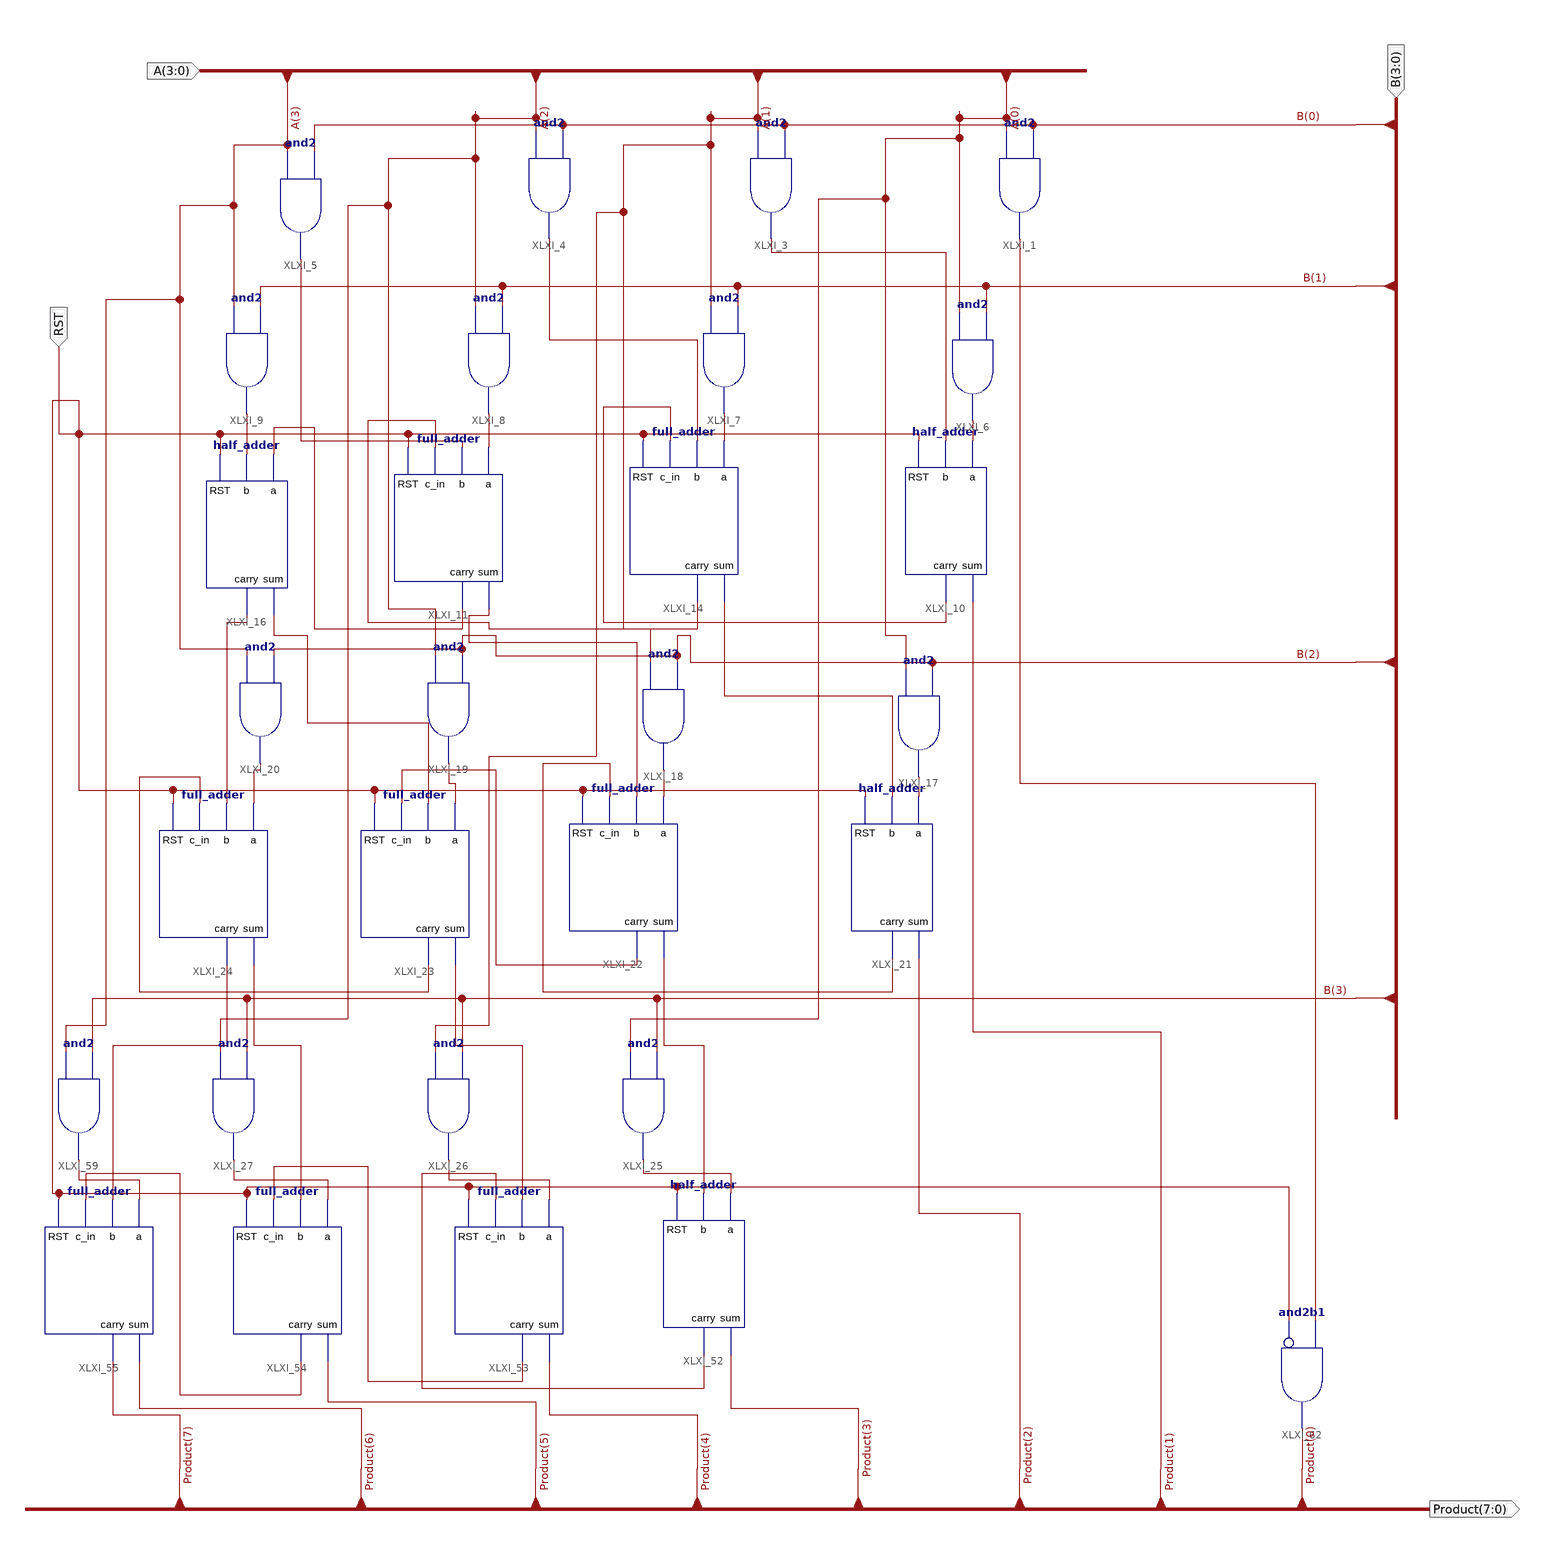
[diagram p0: schematic sheet 1]
// Xilinx ISE schematic multiplier4.sch (artix7) as structural Verilog: 29 symbols, 4 ports
module multiplier4 (
  input  [3:0] A,
  input  [3:0] B,
  input  RST,
  output [7:0] Product
);

  wire XLXN_34, XLXN_35, XLXN_36, XLXN_37, XLXN_38, XLXN_39, XLXN_40, XLXN_41, XLXN_42, XLXN_43, XLXN_66,
       XLXN_67, XLXN_68, XLXN_69, XLXN_70, XLXN_74, XLXN_76, XLXN_78, XLXN_80, XLXN_136, XLXN_138, XLXN_139,
       XLXN_140, XLXN_141, XLXN_142, XLXN_143, XLXN_144, XLXN_145, XLXN_146, XLXN_149, XLXN_151, XLXN_159,
       XLXN_168;

  and XLXI_27 (XLXN_143, A[2], B[3]);
  and XLXI_26 (XLXN_139, A[1], B[3]);
  and XLXI_25 (XLXN_136, A[0], B[3]);
  full_adder XLXI_23 (.a(XLXN_70), .b(XLXN_74), .carry(XLXN_141), .c_in(XLXN_78), .RST(RST), .sum(XLXN_140));
  full_adder XLXI_22 (.a(XLXN_68), .b(XLXN_69), .carry(XLXN_78), .c_in(XLXN_168), .RST(RST), .sum(XLXN_138));
  half_adder XLXI_21 (.a(XLXN_66), .b(XLXN_67), .carry(XLXN_168), .RST(RST), .sum(Product[2]));
  and XLXI_20 (XLXN_76, A[3], B[2]);
  and XLXI_19 (XLXN_70, A[2], B[2]);
  and XLXI_18 (XLXN_68, A[1], B[2]);
  and XLXI_17 (XLXN_66, A[0], B[2]);
  half_adder XLXI_16 (.a(XLXN_43), .b(XLXN_42), .carry(XLXN_80), .RST(RST), .sum(XLXN_74));
  full_adder XLXI_11 (.a(XLXN_40), .b(XLXN_41), .carry(XLXN_43), .c_in(XLXN_37), .RST(RST), .sum(XLXN_69));
  full_adder XLXI_14 (.a(XLXN_38), .b(XLXN_39), .carry(XLXN_37), .c_in(XLXN_36), .RST(RST), .sum(XLXN_67));
  half_adder XLXI_10 (.a(XLXN_34), .b(XLXN_35), .carry(XLXN_36), .RST(RST), .sum(Product[1]));
  and XLXI_9 (XLXN_42, A[3], B[1]);
  and XLXI_8 (XLXN_40, A[2], B[1]);
  and XLXI_7 (XLXN_38, A[1], B[1]);
  and XLXI_6 (XLXN_34, A[0], B[1]);
  and XLXI_3 (XLXN_35, A[1], B[0]);
  and XLXI_5 (XLXN_41, A[3], B[0]);
  and XLXI_4 (XLXN_39, A[2], B[0]);
  and XLXI_1 (XLXN_159, A[0], B[0]);
  half_adder XLXI_52 (.a(XLXN_136), .b(XLXN_138), .carry(XLXN_142), .RST(RST), .sum(Product[3]));
  full_adder XLXI_53 (.a(XLXN_139), .b(XLXN_140), .carry(XLXN_145), .c_in(XLXN_142), .RST(RST), .sum(Product[4]));
  full_adder XLXI_54 (.a(XLXN_143), .b(XLXN_144), .carry(XLXN_149), .c_in(XLXN_145), .RST(RST), .sum(Product[5]));
  full_adder XLXI_24 (.a(XLXN_76), .b(XLXN_80), .carry(XLXN_151), .c_in(XLXN_141), .RST(RST), .sum(XLXN_144));
  full_adder XLXI_55 (.a(XLXN_146), .b(XLXN_151), .carry(Product[7]), .c_in(XLXN_149), .RST(RST), .sum(Product[6]));
  and XLXI_59 (XLXN_146, A[3], B[3]);
  and XLXI_62 (Product[0], ~RST, XLXN_159);  // and2b1
endmodule
